# EAGLE design shinobi_motor (EAGLE 8.2.2)
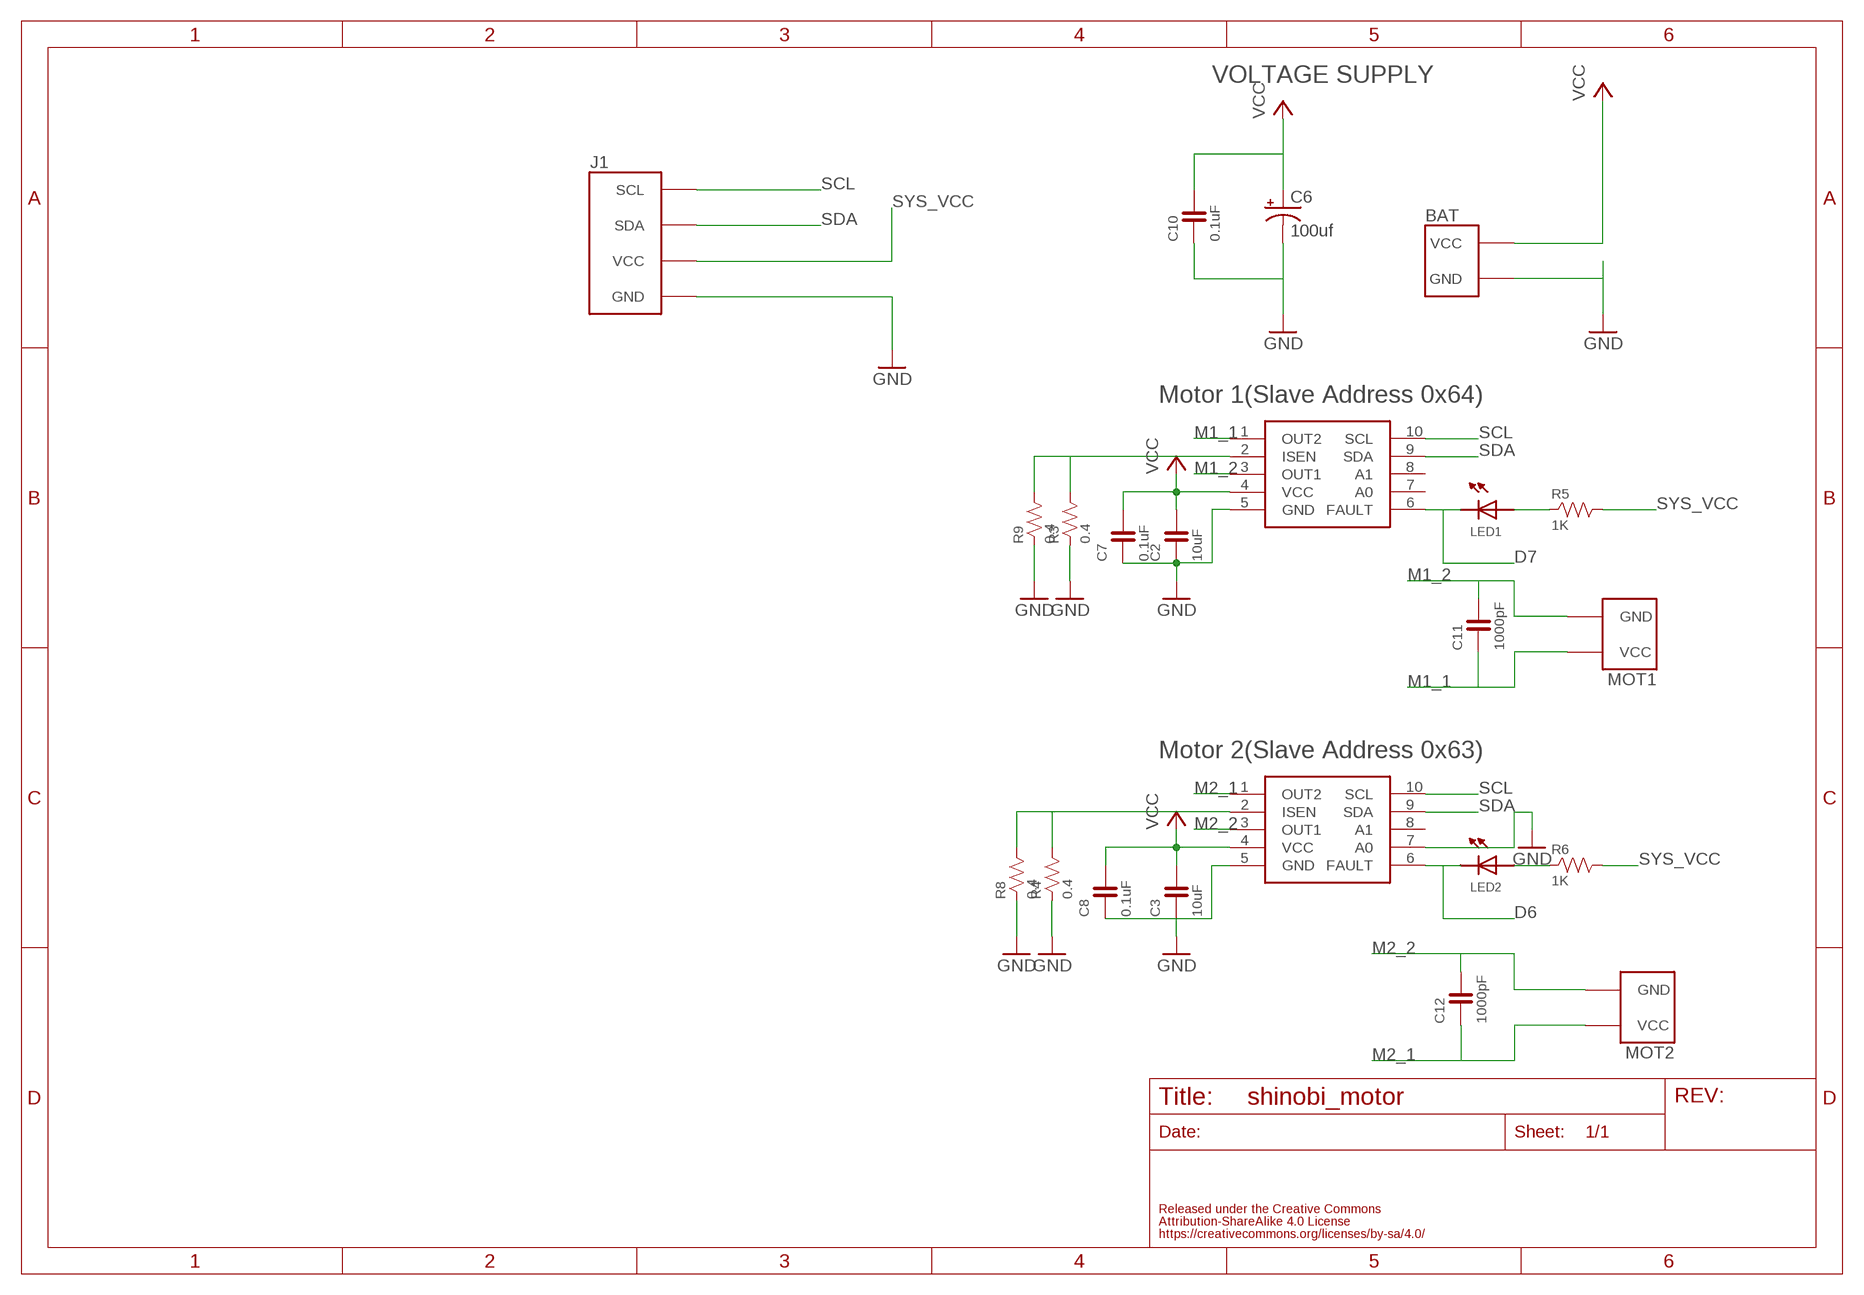
[diagram p0: schematic, sheet 1]

## Parts
BAT  FABO_BRICK_2PIN_SIDE  [FABO_BRICK_2PIN_S02B−PASK-2_SILK]
C2  10uF  CAPACITOR-0603  [0603]
C3  10uF  CAPACITOR-0603  [0603]
C6  100uf  CPOL-US153CLV-0405  [153CLV-0405]
C7  0.1uF  CAPACITOR-0603  [0603]
C8  0.1uF  CAPACITOR-0603  [0603]
C10  0.1uF  CAPACITOR-0603  [0603]
C11  1000pF  CAPACITOR-0603  [0603]
C12  1000pF  CAPACITOR-0603  [0603]
J1  FABO_BRICK_I2C-S04B-PASK-2_LONG  [FABO_BRICK_I2C_S04B-PASK-2_LONG]
LED1  LED-0603  [0603]
LED2  LED-0603  [0603]
MOT1  FABO_BRICK_2PIN_SIDE  [FABO_BRICK_2PIN_S02B−PASK-2_SILK]
MOT2  FABO_BRICK_2PIN_SIDE  [FABO_BRICK_2PIN_S02B−PASK-2_SILK]
R3  0.4  RESISTOR-0603  [0603]
R4  0.4  RESISTOR-0603  [0603]
R5  1K  RESISTOR-0603  [0603]
R6  1K  RESISTOR-0603  [0603]
R8  0.4  RESISTOR-0603  [0603]
R9  0.4  RESISTOR-0603  [0603]
U$8  DRV8830  [DRV8830]
U$10  DRV8830  [DRV8830]

## Nets
D6: LED2.CATHODE U$10.6(FAULT)
D7: LED1.CATHODE U$8.6(FAULT)
GND: BAT.GND C2.1 C3.1 C6.- C7.1 C8.1 C10.1 J1.GND R3.1 R4.1 R8.1 R9.1 U$8.5(GND) U$10.5(GND) U$10.7(A0)
M1_1: C11.1 MOT1.VCC U$8.1(OUT2)
M1_2: C11.2 MOT1.GND U$8.3(OUT1)
M2_1: C12.1 MOT2.VCC U$10.1(OUT2)
M2_2: C12.2 MOT2.GND U$10.3(OUT1)
N$3: R3.2 R9.2 U$8.2(ISEN)
N$4: R4.2 R8.2 U$10.2(ISEN)
N$5: LED1.ANODE R5.1
N$6: LED2.ANODE R6.1
SCL: J1.SCL U$8.10(SCL) U$10.10(SCL)
SDA: J1.SDA U$8.9(SDA) U$10.9(SDA)
SYS_VCC: J1.VCC R5.2 R6.2
VCC: BAT.VCC C2.2 C3.2 C6.+ C7.2 C8.2 C10.2 U$8.4(VCC) U$10.4(VCC)
Unconnected: U$8.7(A0) U$8.8(A1) U$10.8(A1)

## Notes on the sheet
- VOLTAGE SUPPLY
- Motor 1(Slave Address 0x64)
- Motor 2(Slave Address 0x63)

## Library data of the parts
BAT MOT1 MOT2 = FaBo-Template:FABO_BRICK_2PIN
C2 C3 C7 C8 C10-C12 = FaBo-Capacitor:CAPACITOR: CAPACITOR
C6 = resistor:CPOL-US: POLARIZED CAPACITOR, American symbol
J1 = FaBo-Template:FABO_BRICK_I2C: FaBo Brick I2C
LED1 LED2 = FaBo-LED:LED
R3-R6 R8 R9 = FaBo-Resistors:RESISTOR: RESISTOR
U$8 U$10 = FaBo-Motor:DRV8830

## Board
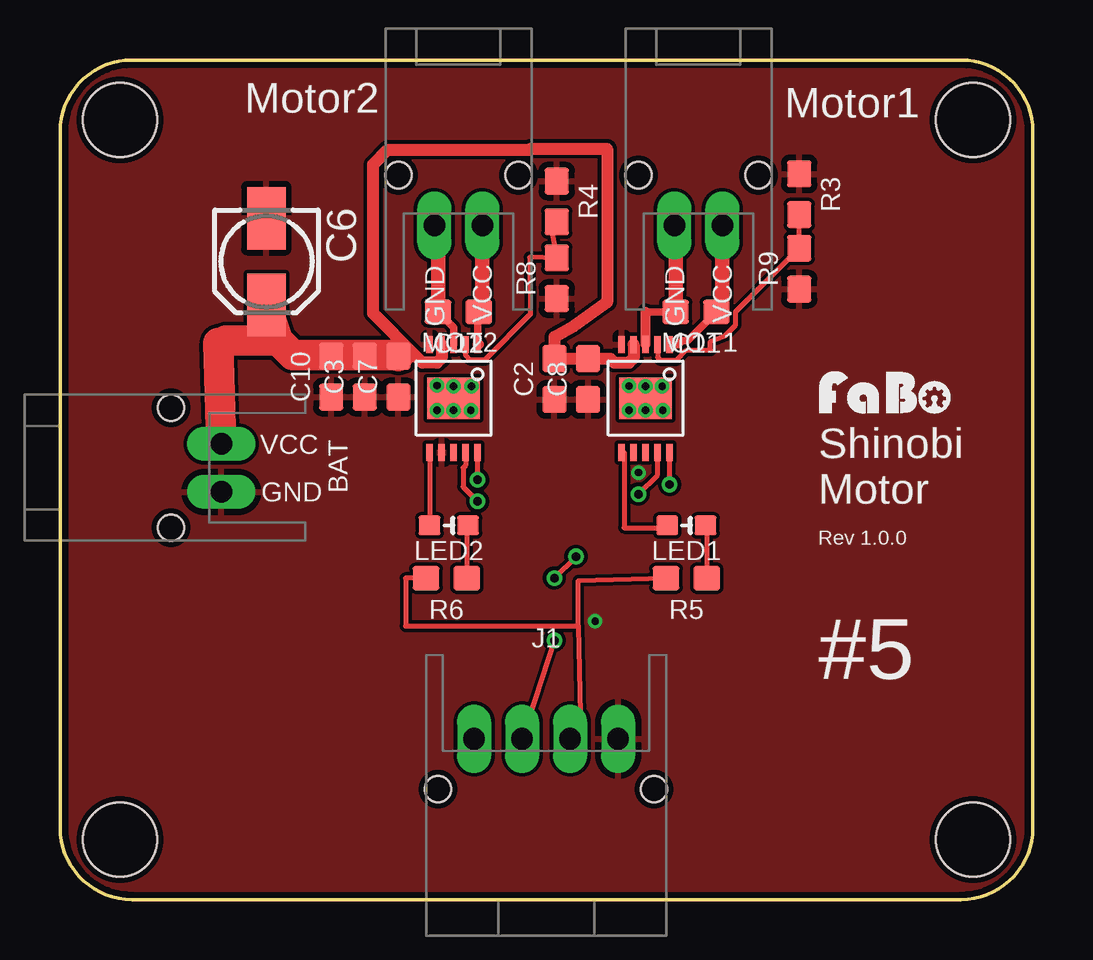
[diagram p1: board, top side]
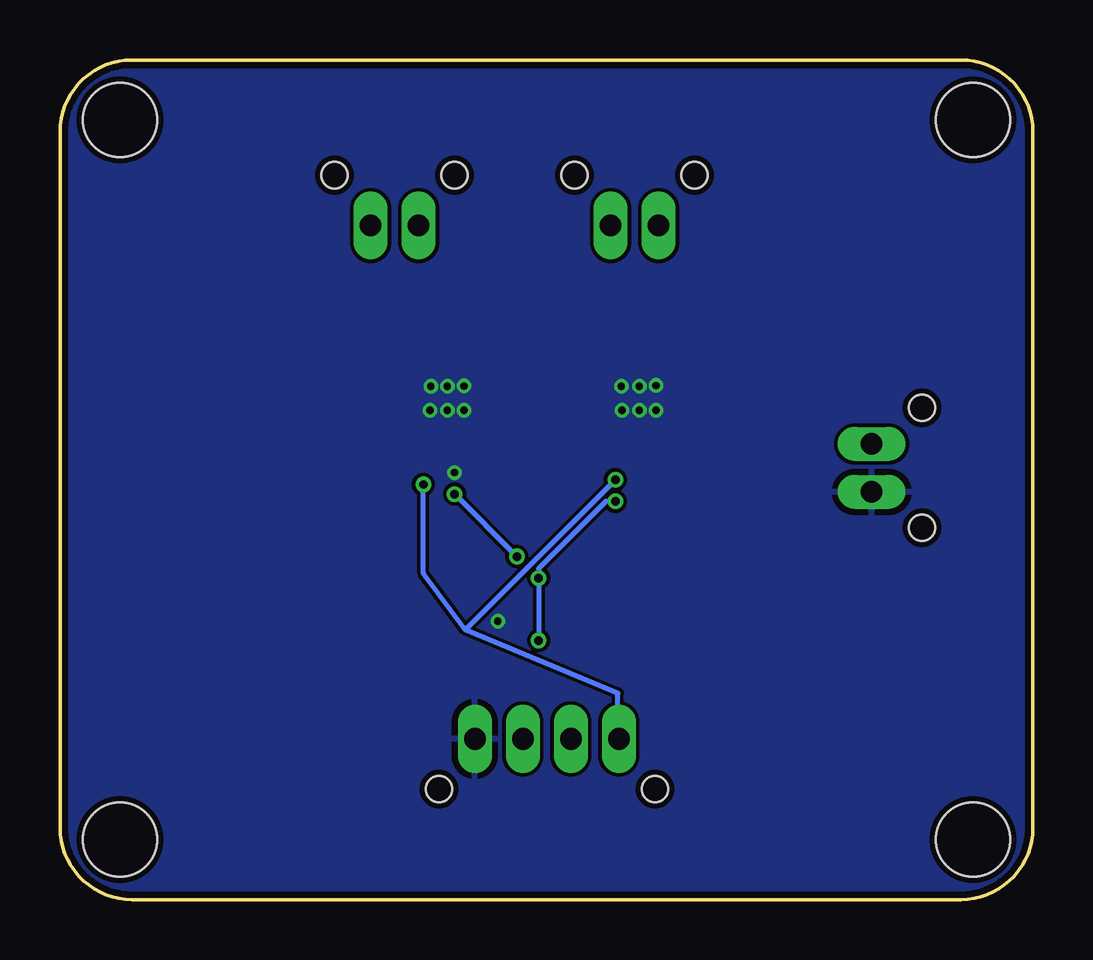
[diagram p2: board, bottom side, seen from below]

Size 40.54 x 35 mm. Coordinates in mm from the lower left corner, seen from the top.
Copper layers (1*16): Top 0.035mm / dielectric 1.5mm / Bottom 0.035mm
Design rules "SeeedStudio_2layer_DRU_no_angle_20140221": minimum track width 6mil, minimum drill 12mil, track to track 6mil, track to pad 6mil, pad to pad 6mil, via to via 6mil, smd to smd 0mil, copper to edge 10mil, drill to drill 10mil, minimum pad ring 10mil, minimum via ring 6mil, stop-mask expansion 2mil, vias tented up to drill 100mil, thermal gap 10mil

### Footprints (pad centres in the part's own frame; a part is rotated, then mirrored left to right if it is on the bottom)
FABO_BRICK_2PIN_S02B−PASK-2_SILK = drill 0.9 pad 1.422 long: GND -1,-0.102; VCC 1,-0.102 | hole 1.1: 2.5,1.998; -2.5,1.998
0603 = smd 1.1 x 1: 1 -0.85,0; 2 0.85,0
153CLV-0405 = smd 2.6 x 1.6: + 1.8,0; - -1.8,0
FABO_BRICK_I2C_S04B-PASK-2_LONG = drill 0.9 pad 1.422 long: GND -3,0; SCL 3,0; SDA 1,0; VCC -1,0 | hole 1.1: 4.5,2.1; -4.5,2.1
0603' = smd 0.9 x 0.8: ANODE -0.8,0; CATHODE 0.8,0
FABO-SHINOBI = hole 3.1: 2.5,32.5; 38.04,32.5; 38.04,2.5; 2.5,2.5
DRV8830 = smd 0.27 x 0.7: 1 -1,-2.24; 2 -0.5,-2.24; 3 0,-2.24; 4 0.5,-2.24; 5 1,-2.24; 6 1,2.26; 7 0.5,2.26; 8 0,2.26; 9 -0.5,2.26; 10 -1,2.26 | smd 2.18 x 1.72: P$1 0,0

### Placement (x,y rotation side)
BAT  6.62,18 90 top
C2  20.6,21.7 90 top
C3  12.7,21.8 90 top
C6  8.6,26.6 270 top
C7  14.1,21.8 90 top
C8  22,21.7 90 top
C10  11.3,21.8 90 top
C11  26.5,24.5 180 top
C12  16.6,24.5 180 top
J1  20.25,6.7 180 top
LED1  [0603']  26.1,15.6 180 top
LED2  [0603']  16.2,15.6 180 top
MOT1  26.6,28.2 0 top
MOT2  16.6,28.2 0 top
R3  30.8,29.4 270 top
R4  20.7,29.1 270 top
R5  26.1,13.4 180 top
R6  16.1,13.4 180 top
R8  20.7,25.9 90 top
R9  30.8,26.3 90 top
U$1  [FABO-SHINOBI]  0,0 0 top
U$2  [LOGO_FABO_S]  34.43,20.12 0 top
U$8  24.4,20.9 180 top
U$10  16.4,20.9 180 top

### Tracks (layer width: path | path; a pad name or v marks a point on that pad's centre or on a via)
D6
  Top 0.2: U$10.6 LED2.CATHODE
D7
  Top 0.2: U$8.6 23.5,18.64 23.5,15.5 25.3,15.5 LED1.CATHODE
GND  (via drill 0.3)
  other vias: 17.15,21.4 17.12,20.4 16.4,20.4 16.4,21.4 15.71,21.43 15.71,20.4 24.4,20.4 24.4,21.4 23.71,21.41 23.71,20.4 25.12,20.4 25.09,21.4 22.3,11.6 24.1,17.8
  pour Bottom: 0,0 41,0 41,35 0,35
  pour Top: 0,0 41,0 41,35 0,35
M1_1
  Top 0.305: U$8.1 25.77,23.14 25.93,23.3 26.16,23.3 C11.1
  Top 0.61: MOT1.VCC 27.6,24.75 C11.1
M1_2
  Top 0.305: 24.4,24.5 C11.2
  Top 0.406: U$8.3 24.4,24.5
  Top 0.61: C11.2 25.65,28.05 MOT1.GND
M2_1
  Top 0.152: U$10.1 17.4,24.27 17.4,24.45 C12.1
  Top 0.305: U$10.1 17.4,24.45 C12.1
  Top 0.406: 17.45,23.14 U$10.1
  Top 0.61: MOT2.VCC 17.6,24.47 17.4,24.27
M2_2
  Top 0.305: U$10.3 16.4,23.85 C12.2
  Top 0.61: C12.2 15.75,27.95 MOT2.GND
N$3
  Top 0.2: U$8.2 24.9,22.6 25,22.5 25.7,22.5 26.1,22.9 27.1,22.9
  Top 0.203: 27.1,22.9 27.1,23.27 27.72,23.52 28.15,23.95 28.15,24.5 R9.2 R3.2
N$4
  Top 0.2: U$10.2 16.9,22.7 17.1,22.5 17.7,22.5 19.6,24.4 19.57,26.78 R8.2 20.4,28.3 20.5,28.6 R4.2
N$5
  Top 0.2: LED1.ANODE 26.95,15.6 R5.1
N$6
  Top 0.2: LED2.ANODE 16.95,15.6 R6.1
SCL  (via drill 0.35)
  Top 0.2: v25.4,17.3 U$8.10 | v17.4,17.5 U$10.10
  Bottom 0.2: v25.4,17.3 25.4,13.6 23.65,11.25 | 23.65,11.25 17.3,8.6 J1.SCL | 23.65,11.25 v17.4,17.5
SDA  (via drill 0.35)
  Top 0.2: v20.6,10.8 J1.SDA | v17.4,16.6 16.8,17.2 16.8,18 16.9,18.1 U$10.9 | U$8.9 24.9,17.7 v24.1,16.9 | v20.6,13.4 v21.5,14.3
  Bottom 0.2: v20.6,10.8 v20.6,13.4 20.6,13.8 17.8,16.6 v17.4,16.6 | v21.5,14.3 v24.1,16.9
SYS_VCC
  Top 0.2: J1.VCC 21.7,6.8 21.6,11.4 | 21.6,11.4 21.6,13.3 R5.2 | R6.2 14.4,13.4 14.4,11.4 21.6,11.4
VCC
  Top 0.203: C3.2 C7.2
  Top 0.508: C7.2 14.83,22.65 | 14.83,22.65 15.1,22.38 15.7,22.38 15.9,22.58 U$10.4 | 14.83,22.65 13.04,24.44 13.04,30.64 13.66,31.26 19.54,31.26 19.59,31.3 22.8,31.3 22.8,24.9 21.4,23.9 20.6,23.45 C2.2 C8.2 22.93,22.55 23.1,22.38 23.7,22.38 23.9,22.58 U$8.4
  Top 1.016: 14,22.65 C10.2 | 14,22.65 14.05,22.7 | C7.2 14,22.65
  Top 1.27: BAT.VCC 6.6,23.2 6.9,23.3 9.1,23.3 | 9.1,23.3 C6.+ | 9.1,23.3 9.7,22.7 14.05,22.7 C7.2

### Text on the board
tPlace: Motor2 | Motor1 | Shinobi | Motor | Rev 1.0.0 | #5